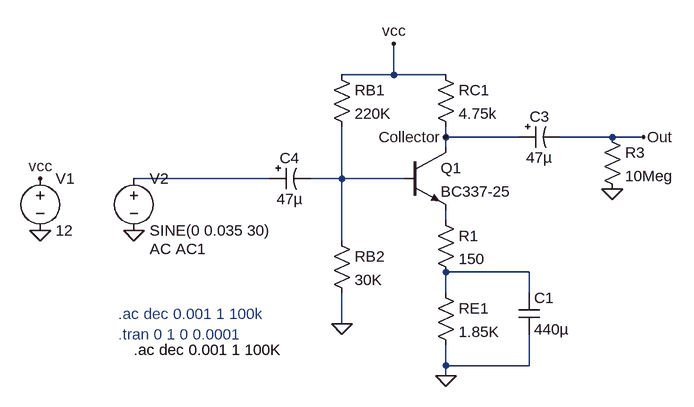
[diagram p0: schematic Draft2.asc]
Draft2.asc, the LTspice schematic file:
Version 4
SHEET 1 880 680
WIRE 144 -32 144 -80
WIRE 144 -32 64 -32
WIRE 224 -32 144 -32
WIRE 224 64 224 48
WIRE 336 64 224 64
WIRE 480 64 400 64
WIRE 528 64 480 64
WIRE 224 80 224 64
WIRE -48 128 -256 128
WIRE 64 128 64 48
WIRE 64 128 16 128
WIRE 160 128 64 128
WIRE 224 192 224 176
WIRE 64 224 64 128
WIRE 352 272 224 272
WIRE 224 304 224 272
WIRE 352 304 352 272
WIRE 64 352 64 304
WIRE 224 416 224 384
WIRE 352 416 352 368
WIRE 352 416 224 416
WIRE 224 432 224 416
FLAG 144 -80 vcc
FLAG 224 432 0
FLAG 64 352 0
FLAG 224 64 Collector
FLAG -400 128 vcc
FLAG -400 208 0
FLAG -256 208 0
FLAG 528 64 Out
FLAG 480 144 0
SYMBOL res 48 -48 R0
SYMATTR InstName RB1
SYMATTR Value 220K
SYMBOL res 208 -48 R0
SYMATTR InstName RC1
SYMATTR Value 4.75k
SYMBOL res 208 288 R0
SYMATTR InstName RE1
SYMATTR Value 1.85K
SYMBOL res 48 208 R0
SYMATTR InstName RB2
SYMATTR Value 30K
SYMBOL polcap 336 48 M90
WINDOW 0 0 32 VBottom 2
WINDOW 3 32 32 VTop 2
SYMATTR InstName C3
SYMATTR Value 47µ
SYMBOL polcap -48 112 M90
WINDOW 0 0 32 VBottom 2
WINDOW 3 32 32 VTop 2
SYMATTR InstName C4
SYMATTR Value 47µ
SYMBOL voltage -400 112 R0
WINDOW 123 0 0 Left 0
WINDOW 39 0 0 Left 0
SYMATTR InstName V1
SYMATTR Value 12
SYMBOL voltage -256 112 R0
WINDOW 123 24 124 Left 2
WINDOW 39 0 0 Left 0
SYMATTR Value2 AC AC1
SYMATTR InstName V2
SYMATTR Value SINE(0 0.035 30)
SYMBOL res 464 48 R0
SYMATTR InstName R3
SYMATTR Value 10Meg
SYMBOL npn 160 80 R0
SYMATTR InstName Q1
SYMATTR Value BC337-25
SYMBOL cap 336 304 R0
SYMATTR InstName C1
SYMATTR Value 440µ
SYMBOL res 208 176 R0
SYMATTR InstName R1
SYMATTR Value 150
TEXT -256 392 Left 2 !.ac dec 0.001 1 100K
TEXT -280 336 Left 2 ;.ac dec 0.001 1 100k
TEXT -280 368 Left 2 ;.tran 0 1 0 0.0001

The netlist it stands for:
* Draft2.asc
RB1 vcc N002 220K
RC1 vcc Collector 4.75k
RE1 N004 0 1.85K
RB2 N002 0 30K
C3 Collector Out 47µ
C4 N001 N002 47µ
V1 vcc 0 12
V2 N001 0 SINE(0 0.035 30) AC AC1
R3 Out 0 10Meg
Q1 Collector N002 N003 0 BC337-25
C1 N004 0 440µ
R1 N003 N004 150
.model NPN NPN
.model PNP PNP
.lib standard.bjt
.ac dec 0.001 1 100K
* .ac dec 0.001 1 100k
* .tran 0 1 0 0.0001
.backanno
.end